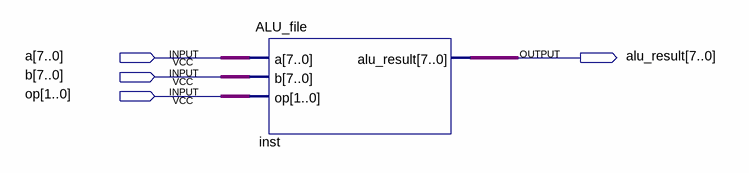
[diagram p0: schematic sheet]
// Quartus schematic block.bdf as structural Verilog: 1 symbols, 4 pins
module block (
  input  [7:0] a,
  input  [7:0] b,
  input  [1:0] op,
  output [7:0] alu_result
);

  ALU_file inst (.a(a), .b(b), .op(op), .alu_result(alu_result));
endmodule
